# Altium schematic sheet eMMC.SchDoc
size A3; SheetNumber: 11; SheetTotal: 23
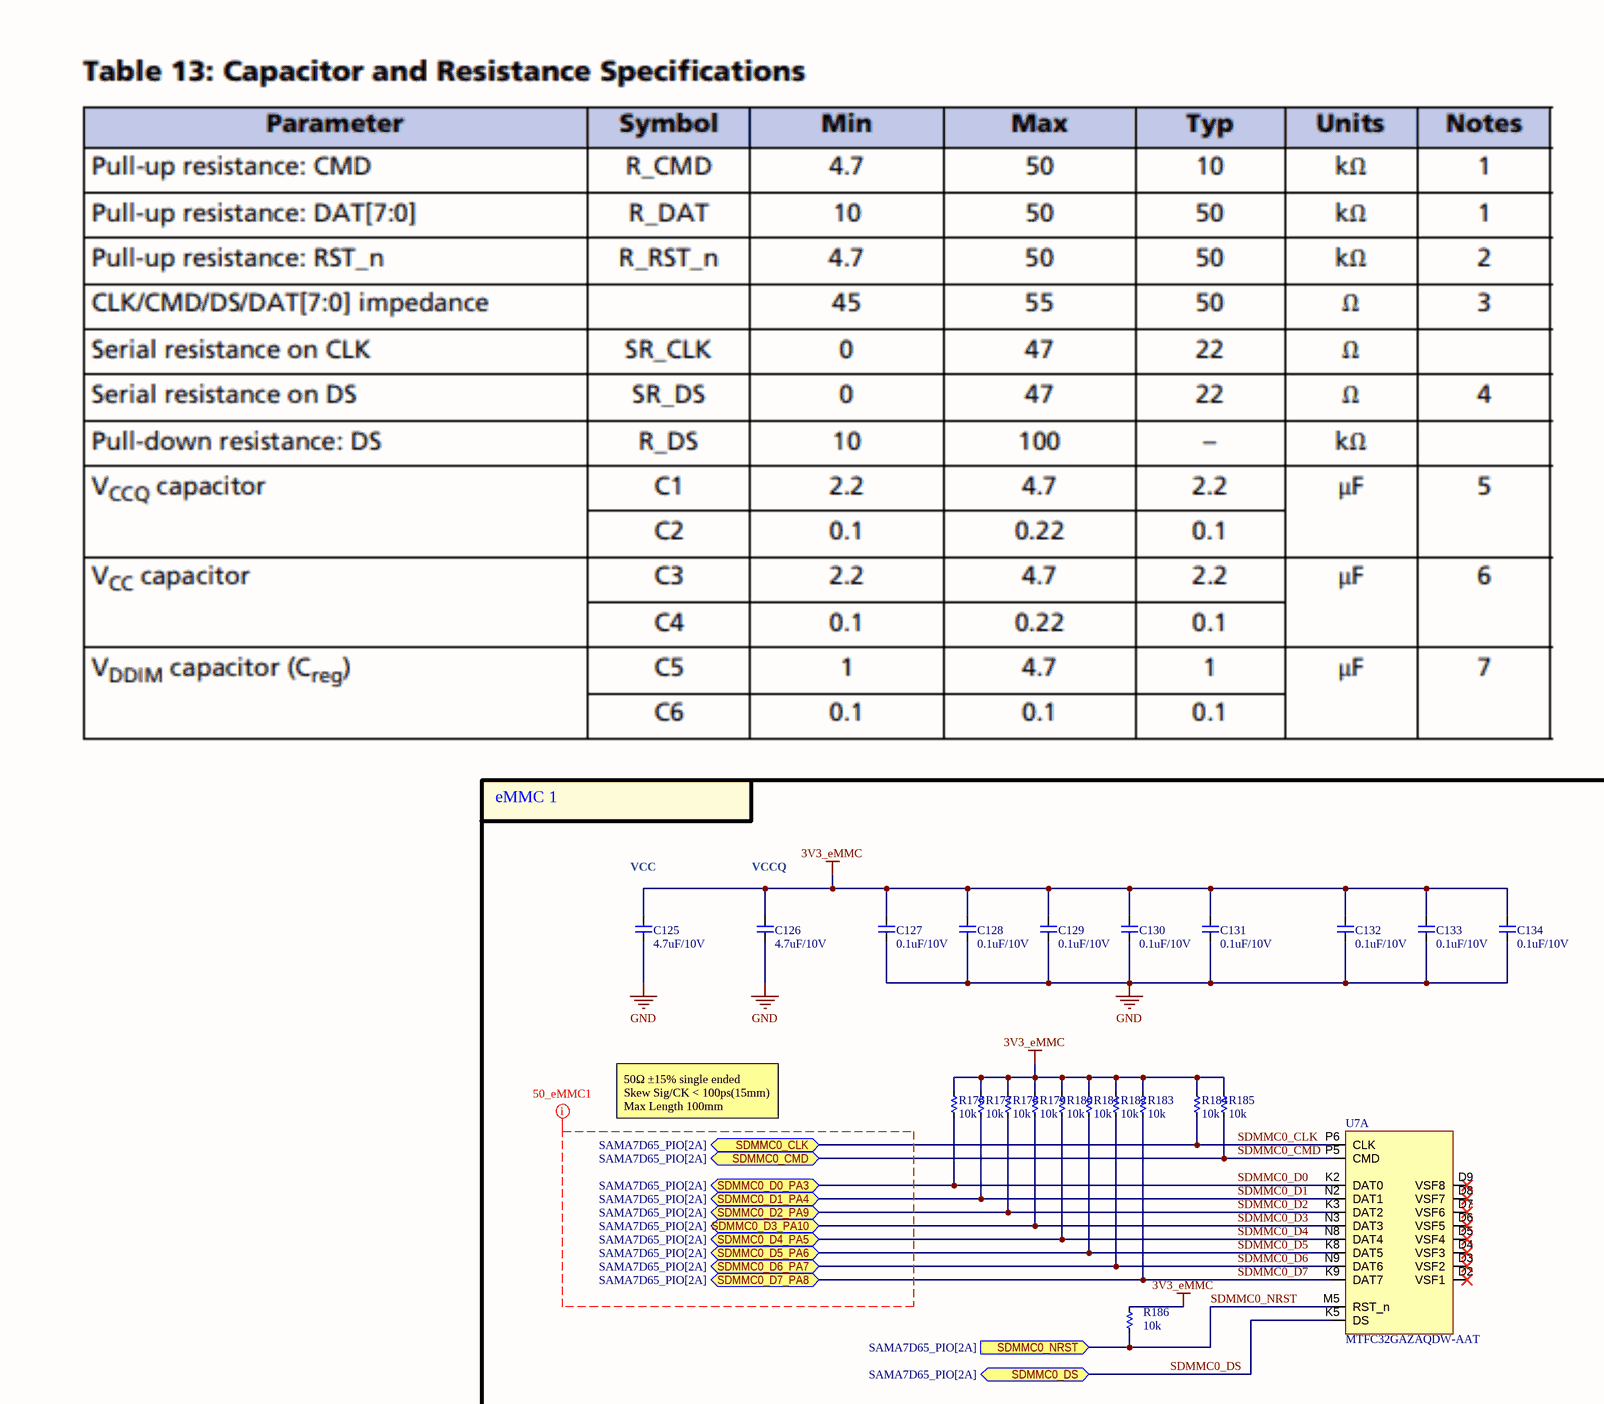
[diagram p0: eMMC.SchDoc, top left]
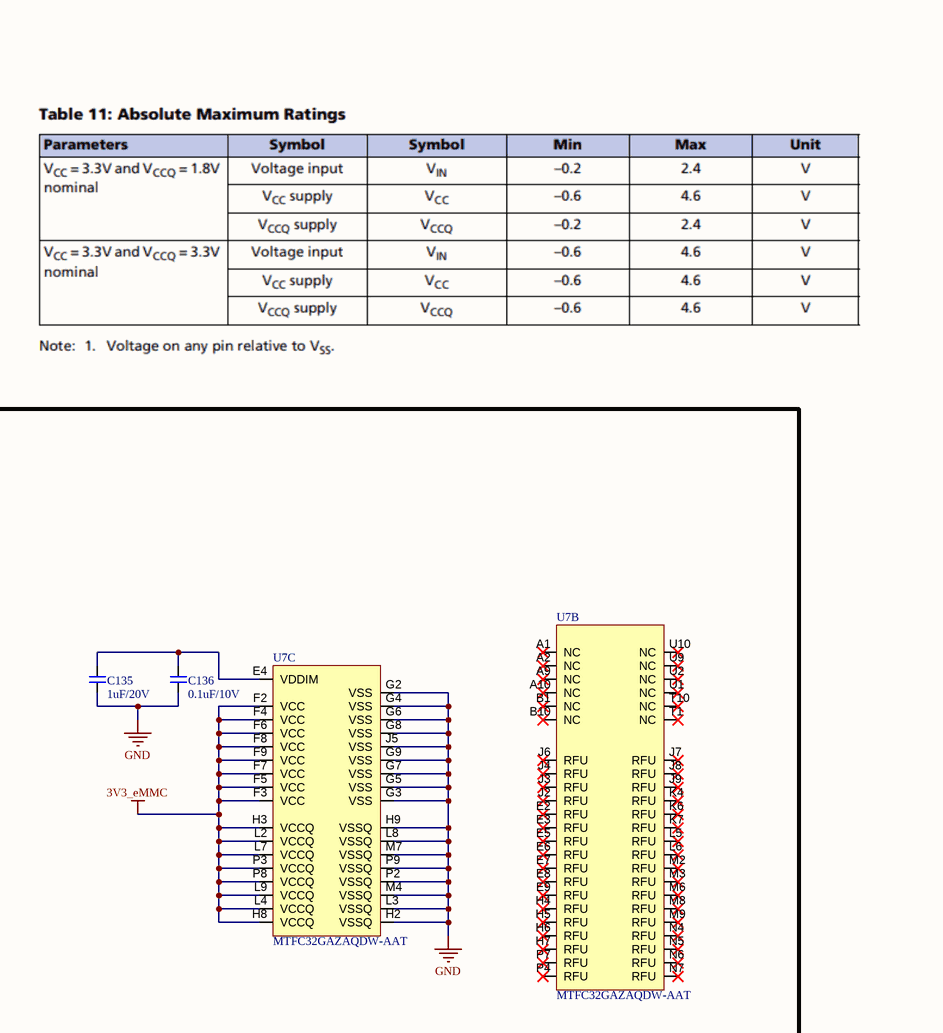
[diagram p1: eMMC.SchDoc, top middle]
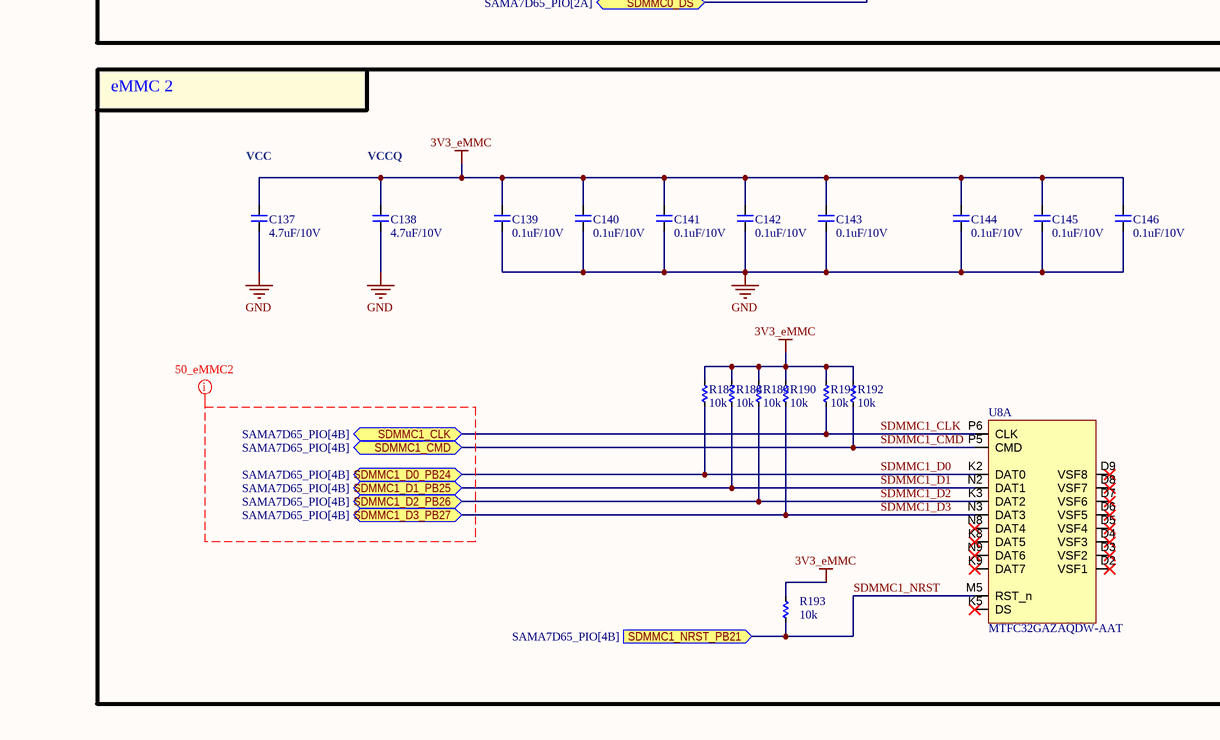
[diagram p2: eMMC.SchDoc, bottom left]
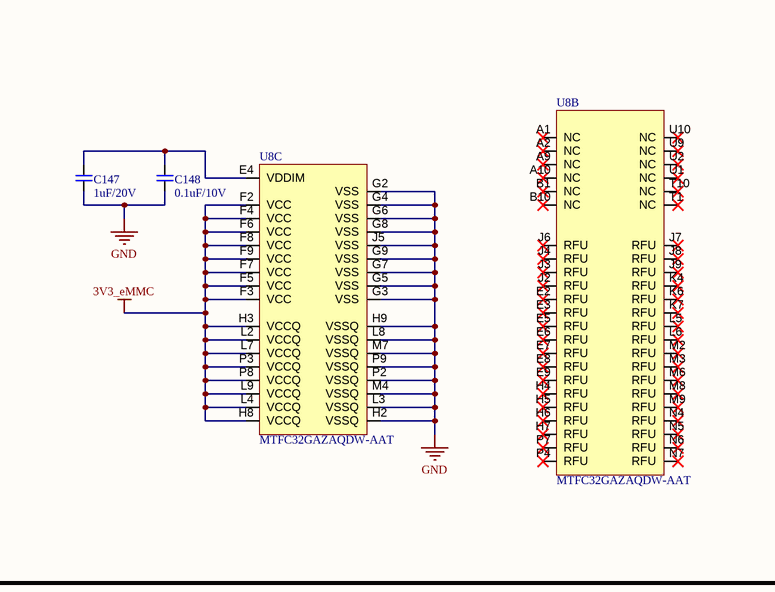
[diagram p3: eMMC.SchDoc, bottom middle]
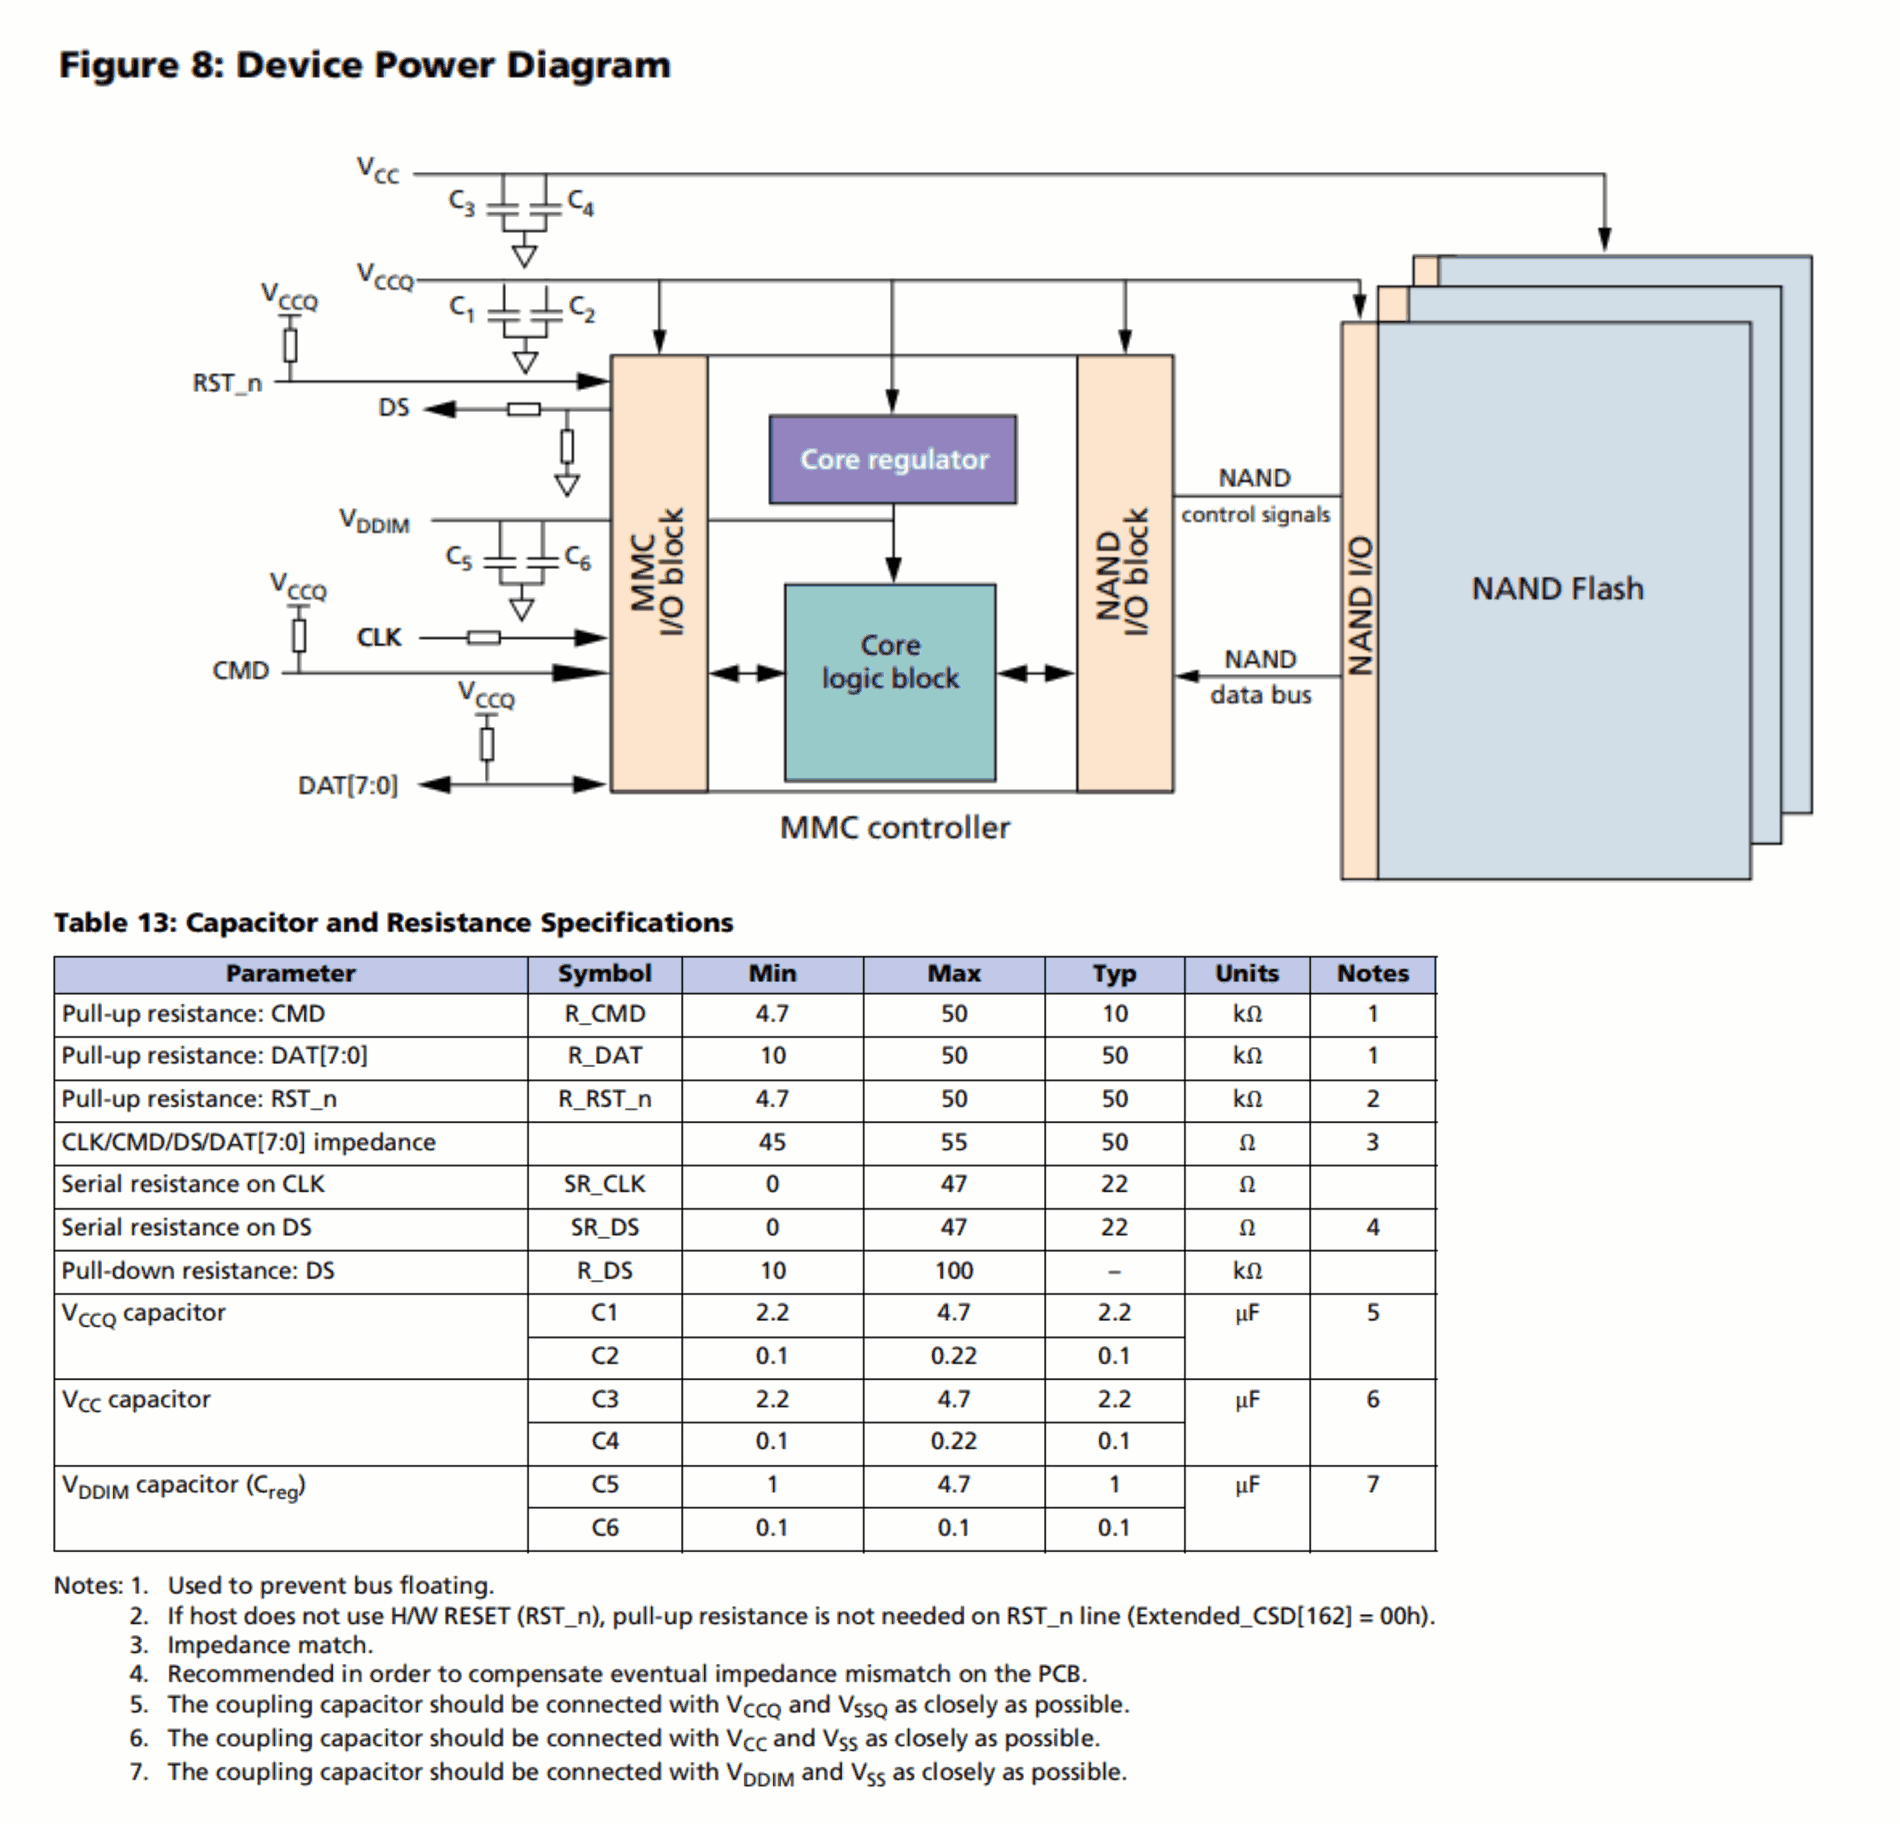
[diagram p4: eMMC.SchDoc, bottom right]

## Parts
C125  4.7uF/10V  [CAP_C_1005X50_L]
C126  4.7uF/10V  [CAP_C_1005X50_L]
C127  0.1uF/10V  [CAP_C_1005X50_L]
C128  0.1uF/10V  [CAP_C_1005X50_L]
C129  0.1uF/10V  [CAP_C_1005X50_L]
C130  0.1uF/10V  [CAP_C_1005X50_L]
C131  0.1uF/10V  [CAP_C_1005X50_L]
C132  0.1uF/10V  [CAP_C_1005X50_L]
C133  0.1uF/10V  [CAP_C_1005X50_L]
C134  0.1uF/10V  [CAP_C_1005X50_L]
C135  1uF/20V  [CAP_C_1005X50_L]
C136  0.1uF/10V  [CAP_C_1005X50_L]
C137  4.7uF/10V  [CAP_C_1005X50_L]
C138  4.7uF/10V  [CAP_C_1005X50_L]
C139  0.1uF/10V  [CAP_C_1005X50_L]
C140  0.1uF/10V  [CAP_C_1005X50_L]
C141  0.1uF/10V  [CAP_C_1005X50_L]
C142  0.1uF/10V  [CAP_C_1005X50_L]
C143  0.1uF/10V  [CAP_C_1005X50_L]
C144  0.1uF/10V  [CAP_C_1005X50_L]
C145  0.1uF/10V  [CAP_C_1005X50_L]
C146  0.1uF/10V  [CAP_C_1005X50_L]
C147  1uF/20V  [CAP_C_1005X50_L]
C148  0.1uF/10V  [CAP_C_1005X50_L]
R176  10k  [RES_C_1005x30_L]
R177  10k  [RES_C_1005x30_L]
R178  10k  [RES_C_1005x30_L]
R179  10k  [RES_C_1005x30_L]
R180  10k  [RES_C_1005x30_L]
R181  10k  [RES_C_1005x30_L]
R182  10k  [RES_C_1005x30_L]
R183  10k  [RES_C_1005x30_L]
R184  10k  [RES_C_1005x30_L]
R185  10k  [RES_C_1005x30_L]
R186  10k  [RES_C_1005x30_L]
R187  10k  [RES_C_1005x30_L]
R188  10k  [RES_C_1005x30_L]
R189  10k  [RES_C_1005x30_L]
R190  10k  [RES_C_1005x30_L]
R191  10k  [RES_C_1005x30_L]
R192  10k  [RES_C_1005x30_L]
R193  10k  [RES_C_1005x30_L]
U7  MTFC32GAZAQDW-AAT  [BGA_100_C_100P_10X17_1400X1800X150]  (parts A,B,C of 3)
U8  MTFC32GAZAQDW-AAT  [BGA_100_C_100P_10X17_1400X1800X150]  (parts A,B,C of 3)

## Blocks framed on the sheet
eMMC 1: C125-C136 R176-R186 U7
eMMC 2: C137-C148 R187-R193 U8

## Ports
SDMMC0_CLK (bidir, see SAMA7D65_PIO[2A]), SDMMC0_CMD (bidir, see SAMA7D65_PIO[2A]), SDMMC0_D0_PA3 (bidir, see SAMA7D65_PIO[2A]), SDMMC0_D1_PA4 (bidir, see SAMA7D65_PIO[2A]), SDMMC0_D2_PA9 (bidir, see SAMA7D65_PIO[2A]), SDMMC0_D3_PA10 (bidir, see SAMA7D65_PIO[2A]), SDMMC0_D4_PA5 (bidir, see SAMA7D65_PIO[2A]), SDMMC0_D5_PA6 (bidir, see SAMA7D65_PIO[2A]), SDMMC0_D6_PA7 (bidir, see SAMA7D65_PIO[2A]), SDMMC0_D7_PA8 (bidir, see SAMA7D65_PIO[2A]), SDMMC0_DS (bidir, see SAMA7D65_PIO[2A]), SDMMC0_NRST (in, see SAMA7D65_PIO[2A]), SDMMC1_CLK (bidir, see SAMA7D65_PIO[4B]), SDMMC1_CMD (bidir, see SAMA7D65_PIO[4B]), SDMMC1_D0_PB24 (bidir, see SAMA7D65_PIO[4B]), SDMMC1_D1_PB25 (bidir, see SAMA7D65_PIO[4B]), SDMMC1_D2_PB26 (bidir, see SAMA7D65_PIO[4B]), SDMMC1_D3_PB27 (bidir, see SAMA7D65_PIO[4B]), SDMMC1_NRST_PB21 (in, see SAMA7D65_PIO[4B])

## Nets
3V3_eMMC: C125.2 C126.2 C127.2 C128.2 C129.2 C130.2 C131.2 C132.2 C133.2 C134.2 C137.2 C138.2 C139.2 C140.2 C141.2 C142.2 C143.2 C144.2 C145.2 C146.2 R176.1 R177.1 R178.1 R179.1 R180.1 R181.1 R182.1 R183.1 R184.1 R185.1 R186.1 R187.1 R188.1 R189.1 R190.1 R191.1 R192.1 R193.1 U7.F2(VCC) U7.F3(VCC) U7.F4(VCC) U7.F5(VCC) U7.F6(VCC) U7.F7(VCC) U7.F8(VCC) U7.F9(VCC) U7.H3(VCCQ) U7.H8(VCCQ) U7.L2(VCCQ) U7.L4(VCCQ) U7.L7(VCCQ) U7.L9(VCCQ) U7.P3(VCCQ) U7.P8(VCCQ) U8.F2(VCC) U8.F3(VCC) U8.F4(VCC) U8.F5(VCC) U8.F6(VCC) U8.F7(VCC) U8.F8(VCC) U8.F9(VCC) U8.H3(VCCQ) U8.H8(VCCQ) U8.L2(VCCQ) U8.L4(VCCQ) U8.L7(VCCQ) U8.L9(VCCQ) U8.P3(VCCQ) U8.P8(VCCQ)
GND: C125.1 C126.1 C127.1 C128.1 C129.1 C130.1 C131.1 C132.1 C133.1 C134.1 C135.1 C136.1 C137.1 C138.1 C139.1 C140.1 C141.1 C142.1 C143.1 C144.1 C145.1 C146.1 C147.1 C148.1 U7.G2(VSS) U7.G3(VSS) U7.G4(VSS) U7.G5(VSS) U7.G6(VSS) U7.G7(VSS) U7.G8(VSS) U7.G9(VSS) U7.H2(VSSQ) U7.H9(VSSQ) U7.J5(VSS) U7.L3(VSSQ) U7.L8(VSSQ) U7.M4(VSSQ) U7.M7(VSSQ) U7.P2(VSSQ) U7.P9(VSSQ) U8.G2(VSS) U8.G3(VSS) U8.G4(VSS) U8.G5(VSS) U8.G6(VSS) U8.G7(VSS) U8.G8(VSS) U8.G9(VSS) U8.H2(VSSQ) U8.H9(VSSQ) U8.J5(VSS) U8.L3(VSSQ) U8.L8(VSSQ) U8.M4(VSSQ) U8.M7(VSSQ) U8.P2(VSSQ) U8.P9(VSSQ)
SDMMC0_CLK: R184.2 U7.P6(CLK) ; port SDMMC0_CLK
SDMMC0_CMD: R185.2 U7.P5(CMD) ; port SDMMC0_CMD
SDMMC0_D0: R176.2 U7.K2(DAT0) ; port SDMMC0_D0_PA3
SDMMC0_D1: R177.2 U7.N2(DAT1) ; port SDMMC0_D1_PA4
SDMMC0_D2: R178.2 U7.K3(DAT2) ; port SDMMC0_D2_PA9
SDMMC0_D3: R179.2 U7.N3(DAT3) ; port SDMMC0_D3_PA10
SDMMC0_D4: R180.2 U7.N8(DAT4) ; port SDMMC0_D4_PA5
SDMMC0_D5: R181.2 U7.K8(DAT5) ; port SDMMC0_D5_PA6
SDMMC0_D6: R182.2 U7.N9(DAT6) ; port SDMMC0_D6_PA7
SDMMC0_D7: R183.2 U7.K9(DAT7) ; port SDMMC0_D7_PA8
SDMMC0_DS: U7.K5(DS) ; port SDMMC0_DS
SDMMC0_NRST: R186.2 U7.M5(RST_n) ; port SDMMC0_NRST
SDMMC1_CLK: R191.2 U8.P6(CLK) ; port SDMMC1_CLK
SDMMC1_CMD: R192.2 U8.P5(CMD) ; port SDMMC1_CMD
SDMMC1_D0: R187.2 U8.K2(DAT0) ; port SDMMC1_D0_PB24
SDMMC1_D1: R188.2 U8.N2(DAT1) ; port SDMMC1_D1_PB25
SDMMC1_D2: R189.2 U8.K3(DAT2) ; port SDMMC1_D2_PB26
SDMMC1_D3: R190.2 U8.N3(DAT3) ; port SDMMC1_D3_PB27
SDMMC1_NRST: R193.2 U8.M5(RST_n) ; port SDMMC1_NRST_PB21
NetC135_2: C135.2 C136.2 U7.E4(VDDIM)
NetC147_2: C147.2 C148.2 U8.E4(VDDIM)

Not connected (* = marked no-connect by the designer): U7 A1(NC)* A2(NC)* A9(NC)* A10(NC)* B1(NC)* B10(NC)* D2(VSF1)* D3(VSF2)* D4(VSF3)* D5(VSF4)* D6(VSF5)* D7(VSF6)* D8(VSF7)* D9(VSF8)* E2(RFU)* E3(RFU)* E5(RFU)* E6(RFU)* E7(RFU)* E8(RFU)* E9(RFU)* H4(RFU)* H5(RFU)* H6(RFU)* H7(RFU)* J2(RFU)* J3(RFU)* J4(RFU)* J6(RFU)* J7(RFU)* J8(RFU)* J9(RFU)* K4(RFU)* K6(RFU)* K7(RFU)* L5(RFU)* L6(RFU)* M2(RFU)* M3(RFU)* M6(RFU)* M8(RFU)* M9(RFU)* N4(RFU)* N5(RFU)* N6(RFU)* N7(RFU)* P4(RFU)* P7(RFU)* T1(NC)* T10(NC)* U1(NC)* U2(NC)* U9(NC)* U10(NC)*; U8 A1(NC)* A2(NC)* A9(NC)* A10(NC)* B1(NC)* B10(NC)* D2(VSF1)* D3(VSF2)* D4(VSF3)* D5(VSF4)* D6(VSF5)* D7(VSF6)* D8(VSF7)* D9(VSF8)* E2(RFU)* E3(RFU)* E5(RFU)* E6(RFU)* E7(RFU)* E8(RFU)* E9(RFU)* H4(RFU)* H5(RFU)* H6(RFU)* H7(RFU)* J2(RFU)* J3(RFU)* J4(RFU)* J6(RFU)* J7(RFU)* J8(RFU)* J9(RFU)* K4(RFU)* K5(DS)* K6(RFU)* K7(RFU)* K8(DAT5)* K9(DAT7)* L5(RFU)* L6(RFU)* M2(RFU)* M3(RFU)* M6(RFU)* M8(RFU)* M9(RFU)* N4(RFU)* N5(RFU)* N6(RFU)* N7(RFU)* N8(DAT4)* N9(DAT6)* P4(RFU)* P7(RFU)* T1(NC)* T10(NC)* U1(NC)* U2(NC)* U9(NC)* U10(NC)*

## Layout directives
net class 50_eMMC1: (no net found under the mark)
net class 50_eMMC2: (no net found under the mark)

## Notes on the sheet
- (near C125) VCC
- (near C126) VCCQ
- 50Ω ±15% single ended
  Skew Sig/CK < 100ps(15mm)
  Max Length 100mm
- (near C137) VCC
- (near C138) VCCQ
- Project:
- Page Contents:
- Revision:
- Design:
- Date:
- Size:
- A3
- Document Number:
- Sheet:
- of

## Library data of the parts
C125-C148 = _CAP_C_2: CAP CHIP
R176-R193 = _RES_B_2: RES